# Altium schematic sheet Sheet2.SchDoc
size 209 x 297 mm; Scale: 1:1; DocumentType: Схема электрическая принципиальная; FirstReferrence: АБВГ.123456.001
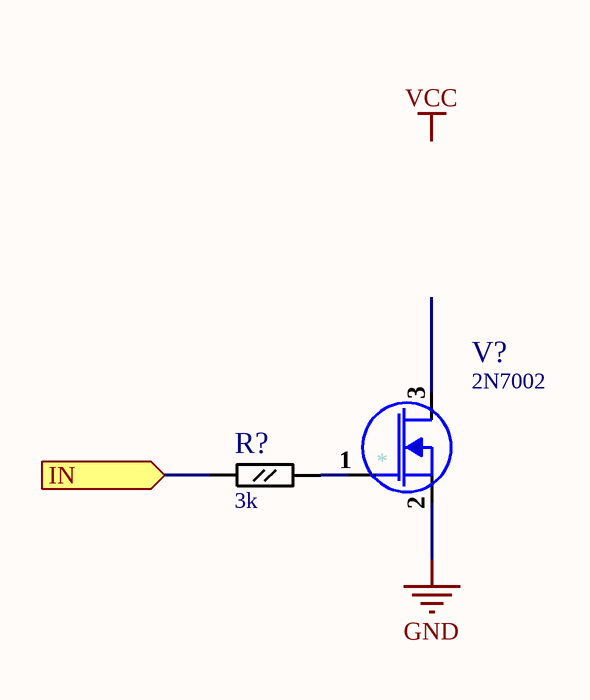
[diagram p0: Sheet2.SchDoc]

## Parts
R?  value 3k  [R0805]  (hidden comment: R0805-0,125 W)
V?  2N7002  [SOT-23]

## Ports
IN (in)

## Nets
GND: V?.2(S)
IN: R?.1 ; port IN
NetR?_2: R?.2 V?.1(G)

Not connected (* = marked no-connect by the designer): V? 3(D)

## Notes on the sheet
- Labels drawn without touching a wire or pin: VCC
- Перв. примен.
- Справ. №
- Подп. и дата
- Инв. № дубл.
- Взам. инв. №
- Разраб.
- Изм.
- Лист
- № докум.
- Подп.
- Дата
- Лит.
- Масса
- Масштаб
- Пров.
- Т.контр.
- Листов
- Инв. № подл.
- Утв.
- Н.контр.
- 2.106-A4
- Копировал
- Формат А4

## Library data of the parts
R? = Resistor 0805 100: TitAD: Резистор; Part Number: Resistor 0805 100; Корпус: R0805
V? = 2N7002: TitAD: Транзистор; Part Number: 2N7002; ManufacturerPartNumber: 2N7002; Корпус: SOT-23